# EAGLE design sonoff DIY, 3 gang(Dip version-V.1.2) (EAGLE 9.6.2)
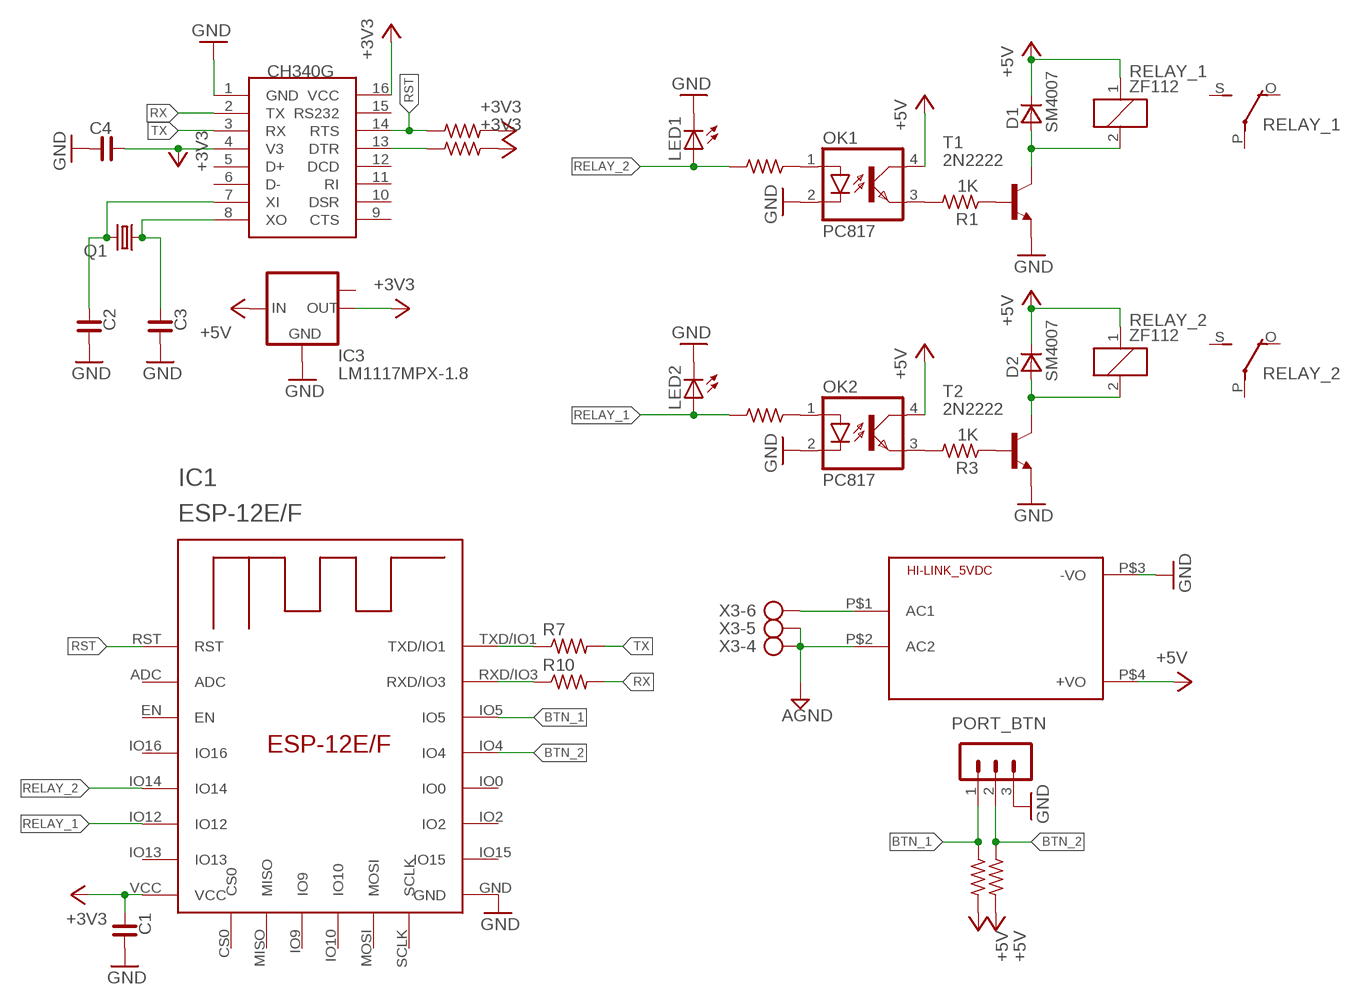
[diagram p0: schematic, sheet 1]

## Parts
C1  C_0805  [C0805]
C2  C_0805  [C0805]
C3  C_0805  [C0805]
C4  C_0805  [C0805]
D1  SM4007  [MELF-MLL41]
D2  SM4007  [MELF-MLL41]
HI-LINK_5VDC  HLK-PM013W  [HLK-PM01]
IC1  ESP-12E/F  [ESP-12E]
IC3  LM1117MPX-1.8  [SOT223]
LED1  LED3MM  [LED3MM]
LED2  LED3MM  [LED3MM]
OK1  PC817  [DIL04]
OK2  PC817  [DIL04]
PORT_BTN  MA03-1  [MA03-1]
Q1  CRYSTALHC18U-V  [HC18U-V]
R1  1K  R_0805  [R0805]
R2  1K  R_0805  [R0805]
R3  1K  R_0805  [R0805]
R4  1K  R_0805  [R0805]
R5  1K  R_0805  [R0805]
R6  1K  R_0805  [R0805]
R7  R-US_0207/10  [0207/10]
R8  1K  R_0805  [R0805]
R9  1K  R_0805  [R0805]
R10  R-US_0207/10  [0207/10]
RELAY_1  ZF112  [ZF112]
RELAY_2  ZF112  [ZF112]
T1  2N2222  [TO18]
T2  2N2222  [TO18]
U$1  CH340G  [SOIC16]
X3  SMKDSP_1,5/6  [SMKDSP_1,5/6]

## Nets
+3V3: C1.2 C4.1 IC1.VCC IC3.2(OUT) R8.1 R9.1 U$1.4(V3) U$1.16(VCC)
+5V: D1.C D2.C HI-LINK_5VDC.P$4(+VO) IC3.3(IN) OK1.4(COL) OK2.4(COL) R5.2 R6.2 RELAY_1.1 RELAY_2.1
AGND: HI-LINK_5VDC.P$2(AC2) X3.4 X3.5
BTN_1: IC1.IO5 PORT_BTN.1 R5.1
BTN_2: IC1.IO4 PORT_BTN.2 R6.1
GND: C1.1 C2.1 C3.1 C4.2 HI-LINK_5VDC.P$3(-VO) IC1.GND IC3.1(GND) LED1.K(C) LED2.K(C) OK1.2(C) OK2.2(C) PORT_BTN.3 T1.1(E) T2.1(E) U$1.1(GND)
N$1: OK1.1(A) R2.1
N$2: OK1.3(EMIT) R1.2
N$3: R1.1 T1.2(B)
N$4: D1.A RELAY_1.2 T1.3(C)
N$6: OK2.1(A) R4.1
N$7: HI-LINK_5VDC.P$1(AC1) X3.6
N$8: OK2.3(EMIT) R3.2
N$9: R3.1 T2.2(B)
N$10: D2.A RELAY_2.2 T2.3(C)
N$12: IC1.TXD/IO1 R7.1
N$15: IC1.RXD/IO3 R10.1
N$16: R9.2 U$1.13(DTR)
N$17: C2.2 Q1.2 U$1.7(XI)
N$18: C3.2 Q1.1 U$1.8(XO)
RELAY_1: IC1.IO12 LED2.A R4.2
RELAY_2: IC1.IO14 LED1.A R2.2
RST: IC1.RST R8.2 U$1.14(RTS)
RX: R10.2 U$1.2(TX)
TX: R7.2 U$1.3(RX)
Unconnected: IC1.ADC IC1.CS0 IC1.EN IC1.IO0 IC1.IO2 IC1.IO9 IC1.IO10 IC1.IO13 IC1.IO15 IC1.IO16 IC1.MISO IC1.MOSI IC1.SCLK IC3.TAB(OUT1) RELAY_1.O(2:O) RELAY_1.P(2:P) RELAY_1.S(2:S) RELAY_2.O(2:O) RELAY_2.P(2:P) RELAY_2.S(2:S) U$1.5(D+) U$1.6(D-) U$1.9(CTS) U$1.10(DSR) U$1.11(RI) U$1.12(DCD) U$1.15(RS232) X3.1 X3.2 X3.3

## Library data of the parts
C1-C4 = rc-master-smd:C_: NON-POLARIZED CAP
D1 D2 = _mod_diode:SM400*: SM4001 .. SM4007 General Purpose Rectifier, 1 A SMD-Version of 1N4001 .. 1N4007 Case: MELF-MLL41 = DO 213 AB Author: Dipl.-Ing. FH Rainer Bayer HHN Hochschule Heilbronn, rainer.bayer@hs-heilbronn.de Ingenieurbüro ing-rb, mail@ing-rb.de
HI-LINK_5VDC = HLK-PM01:HLK-PM01: Hi-Link Power Supply HLK-PM01 3W Author: Ahmed Said <https://github.com/AhmedSaid/EAGLELibraries>
IC1 = esp-12e-f:ESP-12E/F
IC3 = lm1117:LM1117MPX-*
LED1 LED2 = led:LED: LED OSRAM: - CHIPLED LG R971, LG N971, LY N971, LG Q971, LY Q971, LO R971, LY R971 LH N974, LH R974 LS Q976, LO Q976, LY Q976 LO Q996 - Hyper CHIPLED LW Q18S LB Q993, LB Q99A, LB R99A - SideLED LS A670, LO A670, LY A670, LG A670, LP A670 LB A673, LV A673, LT A673, LW A673 LH A674 LY A675 LS A676, LA A676, LO A676, LY A676, LW A676 LS A679, LY A679, LG A679 - Hyper Micro SIDELED® LS Y876, LA Y876, LO Y876, LY Y876 LT Y87S - SmartLED LW L88C, LW L88S LB L89C, LB L89S, LG L890 LS L89K, LO L89K, LY L89K LS L896, LA L896, LO L896, LY L896 - TOPLED LS T670, LO T670, LY T670, LG T670, LP T670 LSG T670, LSP T670, LSY T670, LOP T670, LYG T670 LG T671, LOG T671, LSG T671 LB T673, LV T673, LT T673, LW T673 LH T674 LS T676, LA T676, LO T676, LY T676, LB T676, LH T676, LSB T676, LW T676 LB T67C, LV T67C, LT T67C, LS T67K, LO T67K, LY T67K, LW E67C LS E67B, LA E67B, LO E67B, LY E67B, LB E67C, LV E67C, LT E67C LW T67C LS T679, LY T679, LG T679 LS T770, LO T770, LY T770, LG T770, LP T770 LB T773, LV T773, LT T773, LW T773 LH T774 LS E675, LA E675, LY E675, LS T675 LS T776, LA T776, LO T776, LY T776, LB T776 LHGB T686 LT T68C, LB T68C - Hyper Mini TOPLED® LB M676 - Mini TOPLED Santana® LG M470 LS M47K, LO M47K, LY M47K Source: http://www.osram.convergy.de LUXEON: - LUMILED® LXK2-PW12-R00, LXK2-PW12-S00, LXK2-PW14-U00, LXK2-PW14-V00 LXK2-PM12-R00, LXK2-PM12-S00, LXK2-PM14-U00 LXK2-PE12-Q00, LXK2-PE12-R00, LXK2-PE12-S00, LXK2-PE14-T00, LXK2-PE14-U00 LXK2-PB12-K00, LXK2-PB12-L00, LXK2-PB12-M00, LXK2-PB14-N00, LXK2-PB14-P00, LXK2-PB14-Q00 LXK2-PR12-L00, LXK2-PR12-M00, LXK2-PR14-Q00, LXK2-PR14-R00 LXK2-PD12-Q00, LXK2-PD12-R00, LXK2-PD12-S00 LXK2-PH12-R00, LXK2-PH12-S00 LXK2-PL12-P00, LXK2-PL12-Q00, LXK2-PL12-R00 Source: www.luxeon.com KINGBRIGHT: KA-3528ASYC Source: www.kingbright.com
OK1 OK2 = optocoupler:PC817: SHARP OPTO COUPLER; MPN: PC817X4J000F; OC_FARNELL: 9707727; OC_NEWARK: 97K7059
PORT_BTN = con-lstb:MA03-1: PIN HEADER; OC_FARNELL: unknown; OC_NEWARK: unknown
Q1 = crystal:CRYSTAL: CRYSTAL; OC_FARNELL: unknown; OC_NEWARK: unknown
R1-R6 R8 R9 = rc-master-smd:R_: RESISTOR
R7 R10 = resistor:R-US_: RESISTOR, American symbol
RELAY_1 RELAY_2 = relay:ZF112: RELAY 1 x switch; OC_FARNELL: unknown; OC_NEWARK: unknown
T1 T2 = transistor:2N2222: NPN TRANSISTOR
U$1 = ch340g:CH340G
X3 = con-phoenix-smkdsp:SMKDSP_1,5/6: Printklemme, Nennstrom: 17,5 A, Bemessungsspannung: 250 V, Raster: 5,0 mm Source: http://eshop.phoenixcontact.de .. 1733415.pdf; MF: FARNELL; MPN: 1733619; OC_FARNELL: 3041270; OC_NEWARK: 71C4132

## Board
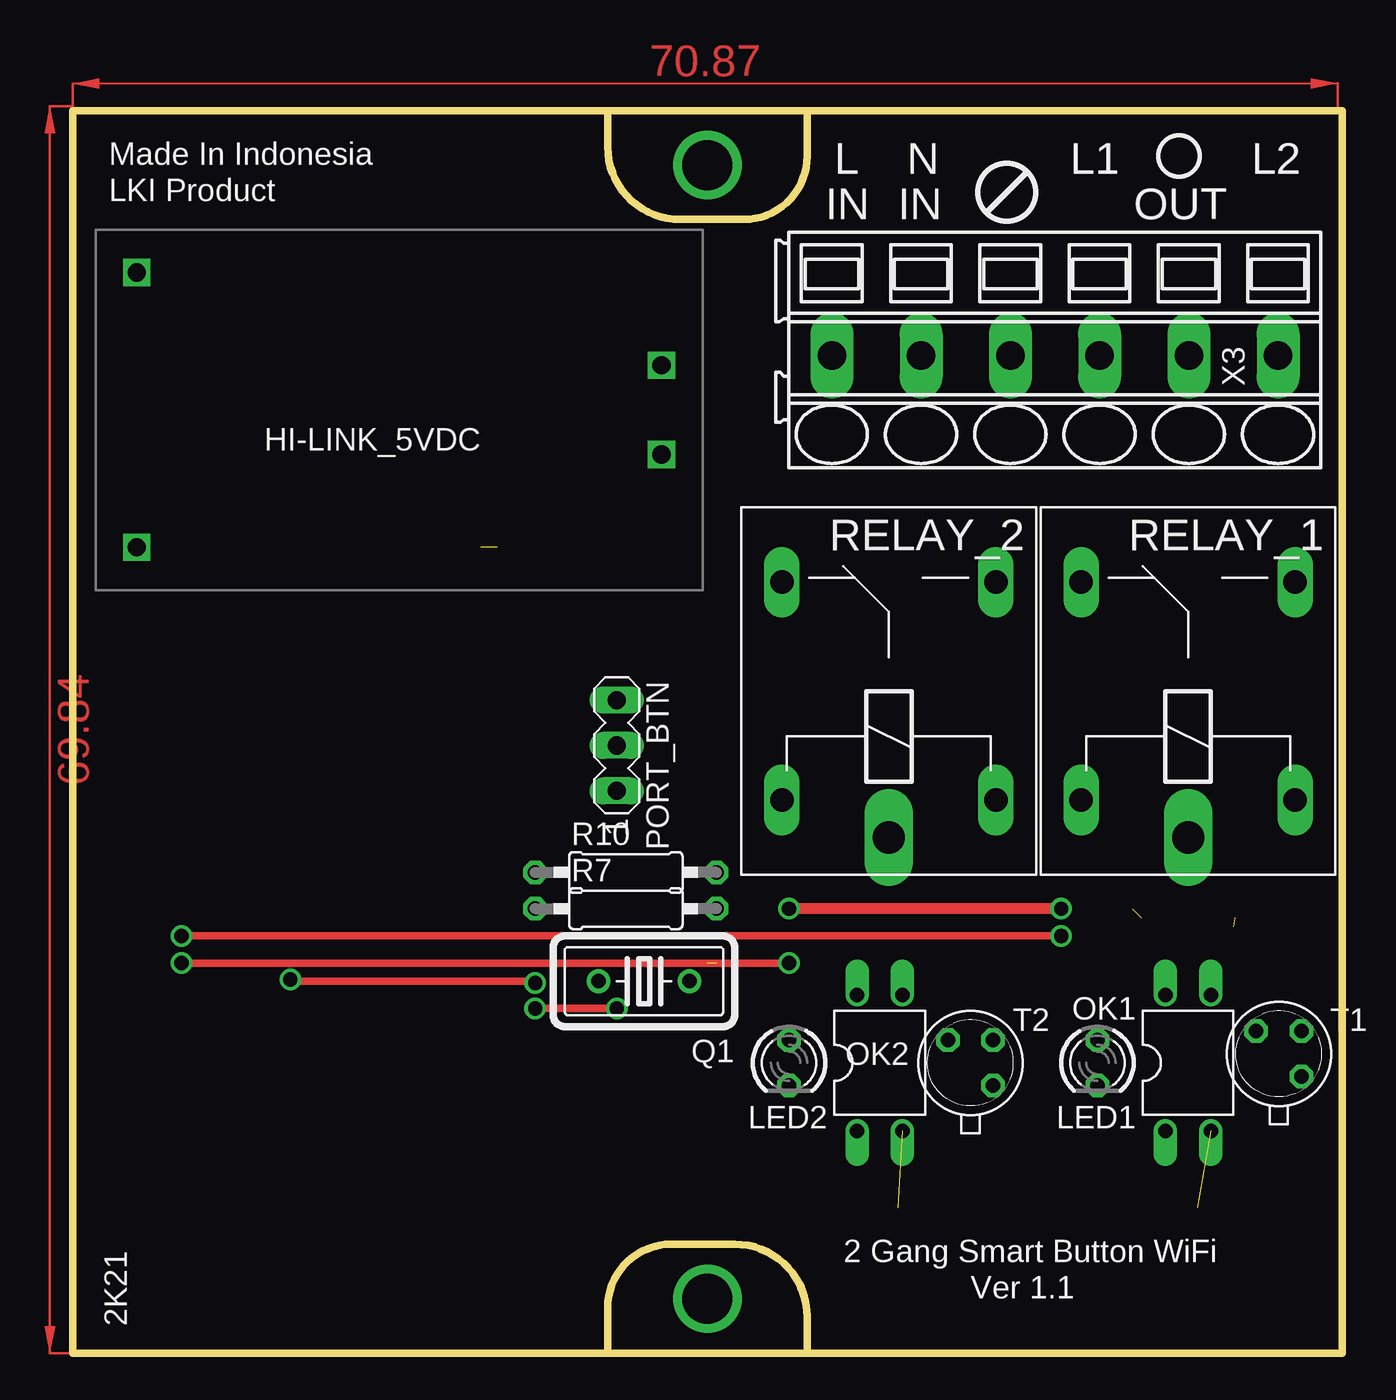
[diagram p1: board, top side]
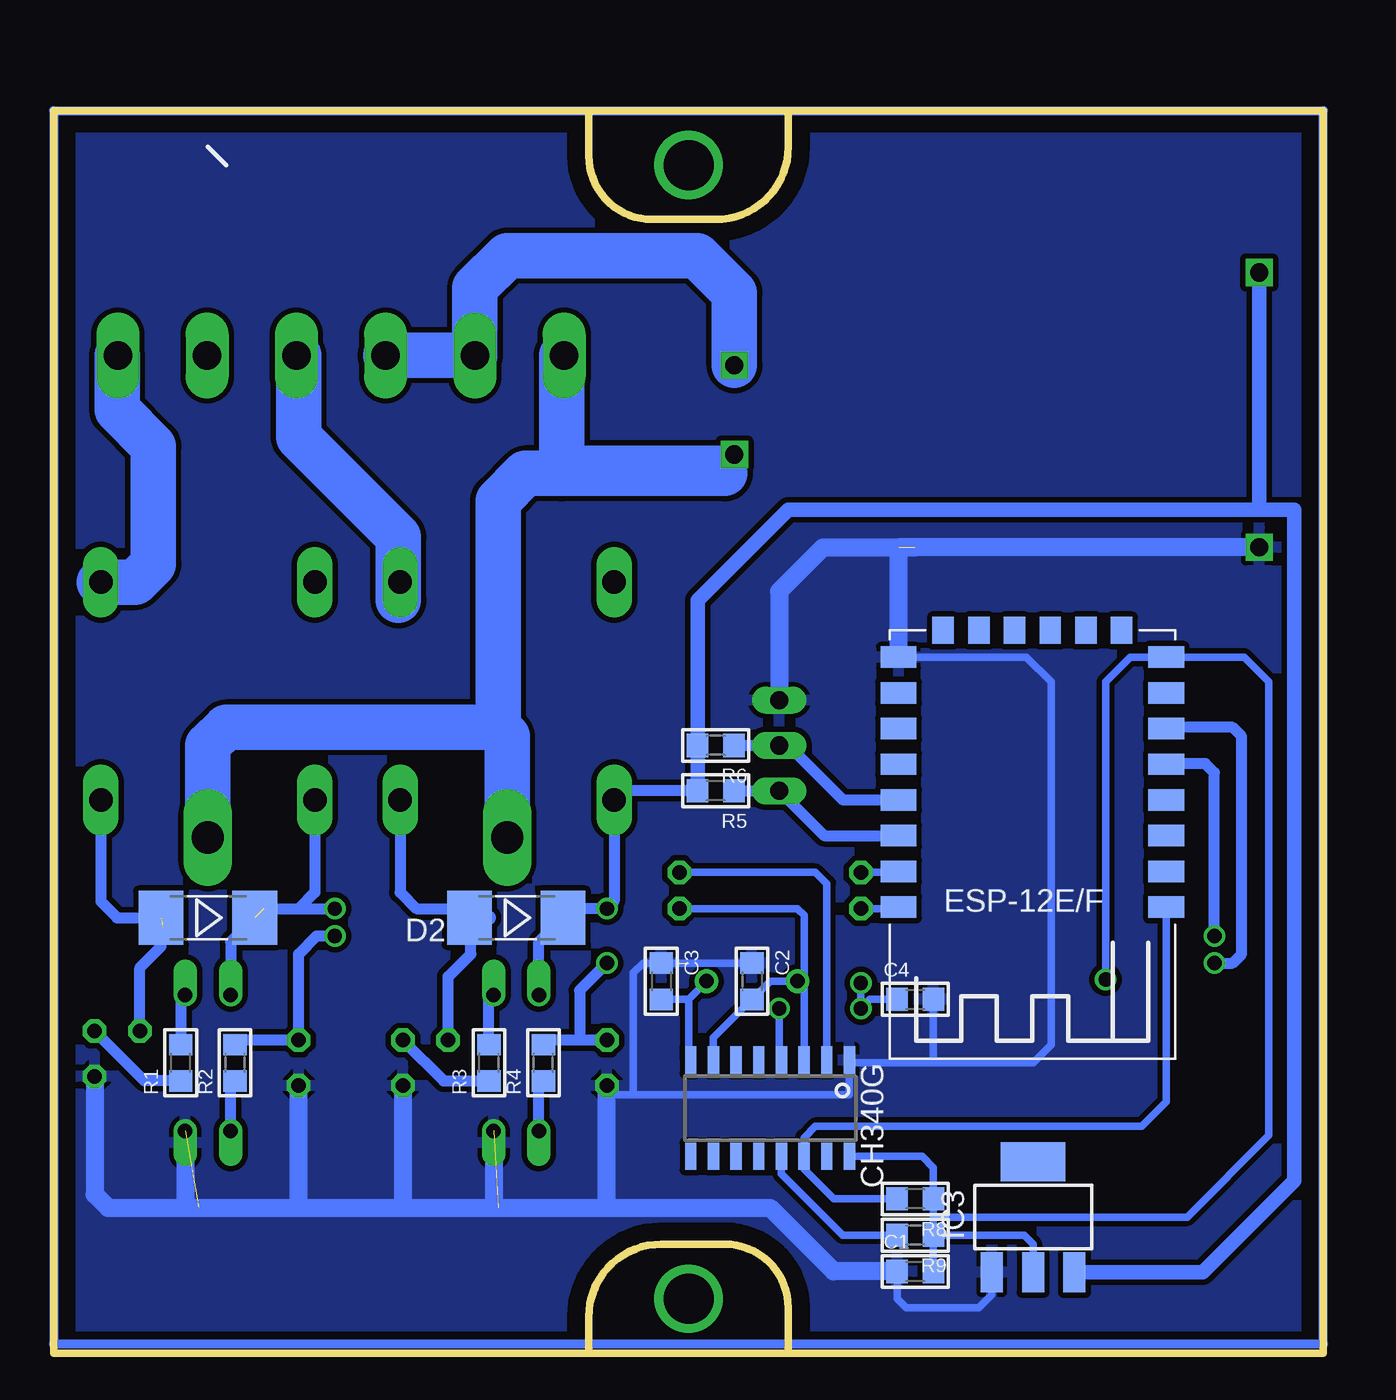
[diagram p2: board, bottom side, seen from below]

Size 71.12 x 69.6 mm. Coordinates in mm from the lower left corner, seen from the top.
Outline: 29.97,69.6 0,69.6 0,0 29.97,0
Outline: 29.97,69.6 29.97,67.56 arc90 34.04,63.5 37.59,63.5 arc90 41.15,67.06 41.15,69.6
Outline: 41.15,69.6 71.12,69.6 71.12,0 41.15,0
Outline: 41.15,0 41.15,2.03 arc90 37.08,6.1 33.53,6.1 arc90 29.97,2.54 29.97,0
Outline: 29.97,69.6 41.15,69.6
Outline: 29.97,0 41.15,0
Copper layers (1*16): Top 0.035mm / dielectric 1.5mm / Bottom 0.035mm
Design rules "default": minimum track width 10mil, minimum drill 24mil, track to track 8mil, track to pad 8mil, pad to pad 8mil, via to via 8mil, smd to smd 8mil, copper to edge 40mil, drill to drill 8mil, minimum pad ring 10mil, minimum via ring 8mil, stop-mask expansion 4mil, vias tented up to drill 0mil, thermal gap 10mil

### Footprints (pad centres in the part's own frame; a part is rotated, then mirrored left to right if it is on the bottom)
C0805 = smd 1.2 x 1.3: 1 -1.016,0; 2 1.016,0
MELF-MLL41 = smd 2.5 x 3: A 2.625,0; C -2.625,0
HLK-PM01 = drill 1.016 square: P$1 -14.7,2.5; P$2 -14.7,-2.5; P$3 14.7,7.7; P$4 14.7,-7.7
ESP-12E = smd 2 x 1.2: ADC -7.46,5.53; EN -7.46,3.53; GND 7.54,-6.47; IO0 7.54,-0.47; IO2 7.54,-2.47; IO4 7.54,1.53; IO5 7.54,3.53; IO12 -7.46,-2.47; IO13 -7.46,-4.47; IO14 -7.46,-0.47; IO15 7.54,-4.47; IO16 -7.46,1.53; RST -7.46,7.53; RXD/IO3 7.54,5.53; TXD/IO1 7.54,7.53; VCC -7.46,-6.47 | smd 1.2 x 1.5: CS0 -4.96,-7.97; IO9 -0.96,-7.97; IO10 1.04,-7.97; MISO -2.96,-7.97; MOSI 3.04,-7.97; SCLK 5.04,-7.97
SOT223 = smd 1.219 x 2.235: 1 -2.311,-3.099; 2 0,-3.099; 3 2.311,-3.099 | smd 3.6 x 2.2: TAB 0,3.099
LED3MM = drill 0.813 octagon: A -1.27,0; K 1.27,0
DIL04 = drill 0.813 offset: 1 -1.27,-3.81; 2 1.27,-3.81; 3 1.27,3.81; 4 -1.27,3.81
MA03-1 = drill 1.016 long: 1 -2.54,0; 2 0,0; 3 2.54,0
HC18U-V = drill 0.813: 1 -2.54,0; 2 2.54,0
R0805 = smd 1.2 x 1.3: 1 -1.016,0; 2 1.016,0
0207/10 = drill 0.813 octagon: 1 -5.08,0; 2 5.08,0
ZF112 = drill 1.321 long: 1 -6.096,5.994; 2 -6.096,-5.994; O 6.096,5.994; S 6.096,-5.994 | drill 1.803 long: P -8.204,0
TO18 = drill 0.813 octagon: 1 -1.27,-1.27; 2 1.27,-1.27; 3 1.27,1.27
SOIC16 = smd 0.635 x 1.524: 1 -4.445,-2.695; 2 -3.175,-2.695; 3 -1.905,-2.695; 4 -0.635,-2.695; 5 0.635,-2.695; 6 1.905,-2.695; 7 3.175,-2.695; 8 4.445,-2.695; 9 4.445,2.695; 10 3.175,2.695; 11 1.905,2.695; 12 0.635,2.695; 13 -0.635,2.695; 14 -1.905,2.695; 15 -3.175,2.695; 16 -4.445,2.695
SMKDSP_1,5/6 = drill 1.6 pad 1.8 long: 1 -2.5,0; 2 2.5,0; 3 7.5,0; 4 12.5,0; 5 17.5,0; 6 22.5,0

### Placement (x,y rotation side)
C1  22.86,4.57 0 bottom
C2  32,20.83 270 bottom
C3  37.08,20.83 270 bottom
C4  22.86,19.81 0 bottom
D1  62.48,24.38 180 bottom
D2  45.21,24.38 180 bottom
HI-LINK_5VDC  18.29,52.83 180 top
IC1  16.26,32.51 180 bottom
IC3  16.26,7.62 0 bottom
LED1  57.4,16.26 270 top
LED2  40.13,16.26 270 top
OK1  62.48,16.26 0 top
OK2  45.21,16.26 0 top
PORT_BTN  30.48,34.04 90 top
Q1  32,20.83 180 top
R1  64.01,16.26 90 bottom
R2  60.96,16.26 90 bottom
R3  46.74,16.26 90 bottom
R4  43.69,16.26 90 bottom
R5  34.04,31.5 180 bottom
R6  34.04,34.04 180 bottom
R7  30.99,24.89 0 top
R8  22.86,8.64 180 bottom
R9  22.86,6.6 180 bottom
R10  30.99,26.92 0 top
RELAY_1  62.48,37.08 90 top
RELAY_2  45.72,37.08 90 top
T1  67.56,16.76 90 top
T2  50.29,16.26 90 top
U$1  30.99,13.72 180 bottom
X3  65.02,55.88 180 top

### Tracks (layer width: path | path; a pad name or v marks a point on that pad's centre or on a via)
+3V3  (via drill 0.8)
  Top 0.406: v30.48,19.3 v25.91,19.3 | v12.19,20.92 v12.2,20.92 12.2,20.83 25.91,20.83 v25.91,20.73
  Bottom 0.406: R9.1 C1.2 | R9.1 R8.1 | R9.1 16.76,6.6 16.26,6.1 IC3.2 | U$1.16 22.48,11.02 21.84,10.39 R8.1 | R8.1 21.84,7.62 7.62,7.62 3.05,12.19 3.05,37.59 4.44,38.98 IC1.VCC 10.8,38.98 12.19,37.59 v12.19,20.92 | C4.1 25.4,19.81 v25.91,19.3 v25.91,20.73 | v30.48,19.3 30.48,16.54 U$1.4
+5V  (via drill 0.8)  (1 unrouted)
  Top 0.61: v55.37,24.89 v40.13,24.89
  Bottom 0.61: D1.C 61.21,23.03 OK1.4 | OK2.4 43.94,23.03 D2.C 42.08,24.89 v40.13,24.89 39.73,25.3 RELAY_2.1 39.22,31.5 R5.2 | 59.35,24.89 57.4,24.89 | 57.4,24.89 v55.37,24.89 | RELAY_1.1 56.49,25.81 57.4,24.89
  Bottom 0.813: 60.45,23.79 D1.C 59.94,24.38 | D2.C 42.67,24.3 | 3.59,47.24 HI-LINK_5VDC.P$4 | 3.59,47.24 29.97,47.24 35.05,42.16 R6.2 R5.2 | IC3.3 6.76,4.52 1.63,9.65 1.63,47.24 3.59,47.24
AGND
  Bottom 2.54: HI-LINK_5VDC.P$2 32.99,59.4 35.06,61.47 45.72,61.47 47.52,59.66 X3.5 X3.4
BTN_1
  Bottom 0.61: IC1.IO5 27.97,28.98 PORT_BTN.1 | PORT_BTN.1 | R5.1 PORT_BTN.1
BTN_2
  Bottom 0.61: IC1.IO4 26.92,30.98 29.97,34.04 PORT_BTN.2 R6.1
GND  (4 unrouted)
  Bottom 0.406: IC3.1 18.57,3.28 19.3,2.54 23.37,2.54 23.88,3.05 C1.1 | LED2.K 40.13,14.48 38.61,14.48 | 38.61,14.48 26.54,14.48 U$1.1 26.39,16.26 21.84,16.26 | 21.84,16.26 16.26,16.26 15.24,17.27 15.24,37.59 16.63,38.98 IC1.GND | 23.8,45.05 23.88,45.13 | C2.1 36.08,21.84 | 35.55,21.84 C3.1 38.1,21.84 38.65,21.3 38.65,14.52 38.61,14.48 | C4.2 21.84,16.26
  Bottom 1.016: HI-LINK_5VDC.P$3 23.8,45.13 | 22.86,45.13 23.88,45.13 28.02,45.13 30.48,42.67 PORT_BTN.3 | T2.1 51.56,8.38 51.82,8.13 | 51.82,8.13 46.23,8.13 | 40.13,8.13 46.48,8.13 OK2.2 | 40.13,8.13 LED2.K | T1.1 68.83,8.89 68.07,8.13 62.99,8.13 | 57.4,8.13 63.75,8.13 OK1.2 | 57.4,8.13 LED1.K | 57.4,8.13 51.82,8.13 | C1.1 27.43,4.57 30.99,8.13 40.13,8.13 | IC1.GND 23.8,45.05
  pour Bottom (isolate 0.305): 0,69.6 71.12,69.6 71.12,0 0,0
N$1
  Bottom 0.61: OK1.1 61.21,14.99 R2.1
N$2
  Bottom 0.61: OK1.3 64.01,19.81 R1.2
N$3
  Bottom 0.61: R1.1 66.04,15.24 T1.2
N$4  (1 unrouted)
  Bottom 0.61: T1.3 66.29,21.59 65.11,22.78 D1.A 67.56,24.38 68.48,25.3 RELAY_1.2
  Bottom 0.813: 64.52,23.88 65.02,23.88
N$5
  Bottom 2.54: 45.72,27.43 45.72,34.54 46.23,35.05 61.47,35.05 62.48,34.04 62.48,27.43
N$6
  Bottom 0.61: OK2.1 43.94,14.99 R4.1
N$7
  Bottom 1.016: HI-LINK_5VDC.P$1 41.62,50.33 42.67,49.28 42.67,55.73 X3.6
N$8
  Bottom 0.61: R3.2 46.74,19.81 OK2.3
N$9
  Bottom 0.61: T2.2 49.28,15.24 R3.1
N$10
  Bottom 0.61: T2.3 49.02,21.08 47.75,22.35 47.75,24.3 D2.A 47.75,24.47 47.75,24.89 50.8,24.89 51.71,25.81 RELAY_2.2
  Bottom 0.813: 46.74,24.38 D2.A
N$11
  Bottom 2.54: 46.23,35.56 46.23,47.75 44.7,49.28 42.67,49.28 | 33.53,49.28 42.67,49.28 | 42.67,55.88 42.67,49.28
N$12
  Bottom 0.406: R7.1 23.89,24.89 IC1.TXD/IO1
  Bottom 0.61: 24.47,24.98 IC1.TXD/IO1
N$13
  Bottom 2.54: 68.58,43.18 66.55,43.18 65.53,44.2 65.53,50.8 67.56,52.83 67.56,55.88
N$14
  Bottom 2.54: 51.82,42.16 51.82,45.72 57.4,51.31 57.4,55.88
N$15
  Bottom 0.406: R10.1 23.85,26.92 IC1.RXD/IO3
  Bottom 0.61: 24.33,26.98 IC1.RXD/IO3
N$16
  Bottom 0.406: R9.2 26.92,6.6 30.35,10.03 U$1.13
N$17
  Bottom 0.406: Q1.2 30.99,20.83 C2.2 34.16,17.65 U$1.7
N$18
  Bottom 0.406: Q1.1 35.56,19.81 | 35.56,19.81 35.56,16.54 U$1.8 | C3.2 35.56,19.81
N$21  (via drill 2.8 pad 1.27)
  other vias: 35.56,66.55
N$28  (via drill 2.8 pad 1.27)
  other vias: 35.56,3.05
N$30
  Bottom 0.508: 71.12,69.6 0,69.6 0,0.51 71.12,0.51 71.12,69.6
RELAY_1  (via drill 0.8)
  Top 0.406: v40.13,21.84 v6.1,21.84
  Bottom 0.61: R4.2 43.43,17.53 LED2.A 41.66,17.53 41.66,20.32 v40.13,21.84 | v6.1,21.84 5.08,21.84 4.57,22.35 4.57,34.54 5.08,35.05 8.73,35.05 IC1.IO12
RELAY_2  (via drill 0.8)
  Top 0.406: v55.37,23.37 v6.1,23.37
  Bottom 0.61: R2.2 60.71,17.53 LED1.A 57.4,22.35 56.39,23.37 v55.37,23.37 | v6.1,23.37 6.1,32.51 6.6,33.02 8.76,33.02 IC1.IO14
RST
  Bottom 0.406: IC1.RST 8.8,14.06 10.16,12.7 28.45,12.7 29.08,12.07 U$1.14 29.08,10.29 27.43,8.64 R8.2
RX
  Bottom 0.406: R10.2 28.45,26.92 27.81,26.29 U$1.2
TX
  Bottom 0.406: U$1.3 29.08,24.51 29.46,24.89 R7.2
(copper drawn outside any net)
  shapes: Top area x2

### Text on the board
tNames: Made In Indonesia | L | N | L1 | L2 | LKI Product | IN | IN | OUT | 2 Gang Smart Button WiFi | Ver 1.1 | 2K21